# EAGLE design USB_Bit_Whacker-18F2553 (EAGLE 7.5.0)
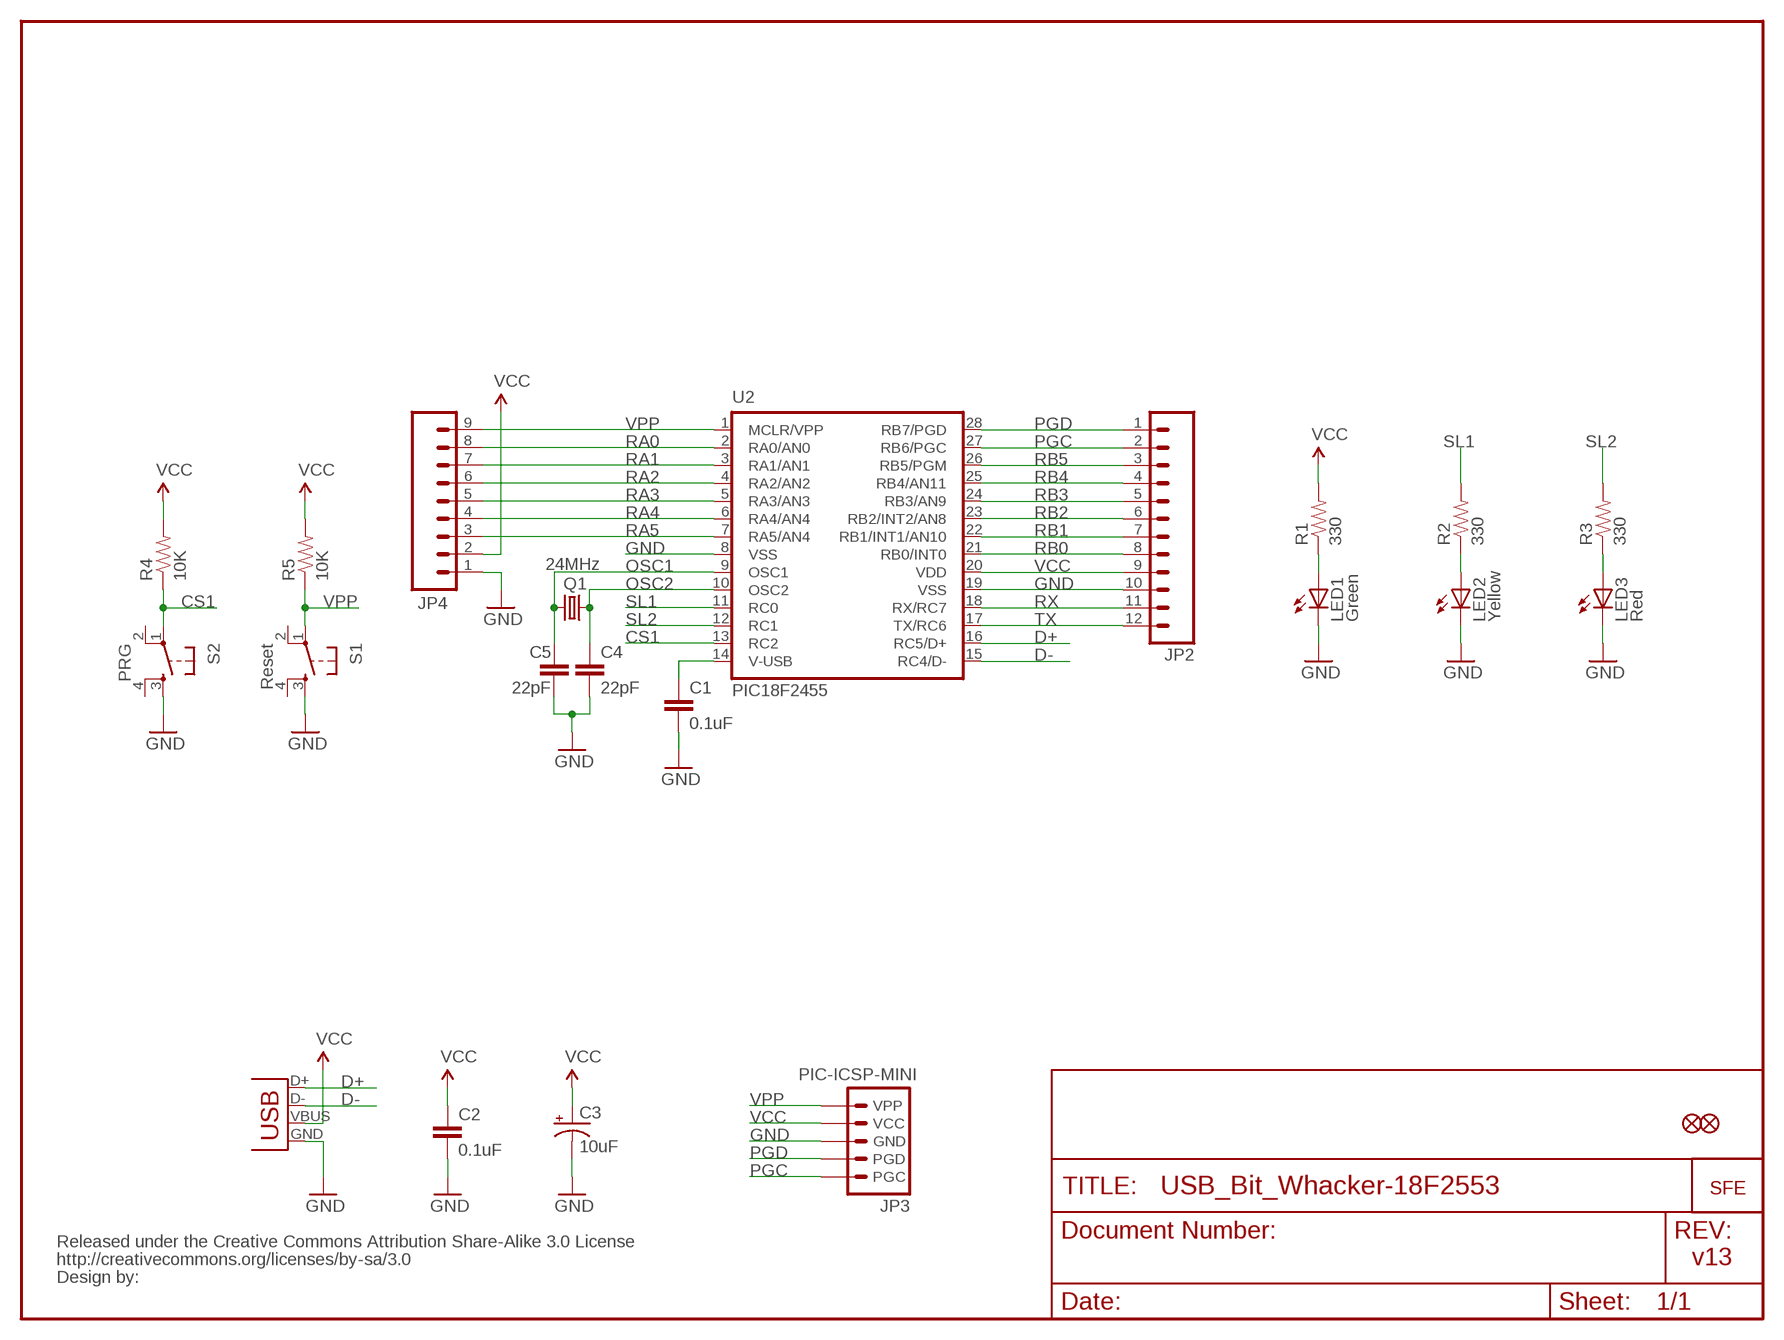
[diagram p0: schematic, sheet 1]

## Parts
C1  0.1uF  CAP0402-CAP  [0402-CAP]
C2  0.1uF  CAP0402-CAP  [0402-CAP]
C3  10uF  CAP_POL1206  [EIA3216]
C4  22pF  CAP0402-CAP  [0402-CAP]
C5  22pF  CAP0402-CAP  [0402-CAP]
FID1  FIDUCIAL1X2  [FIDUCIAL-1X2]
FID2  FIDUCIAL1X2  [FIDUCIAL-1X2]
JP2  M12PTH  [1X12]
JP3  PIC-ICSP-MINI  [PIC-ICSP-MINI]
JP4  M09  [1X09]
LED1  Green  LED1206  [LED-1206]
LED2  Yellow  LED1206  [LED-1206]
LED3  Red  LED1206  [LED-1206]
Q1  24MHz  CRYSTAL5X3  [CRYSTAL-SMD-5X3]
R1  330  RESISTOR0402-RES  [0402-RES]
R2  330  RESISTOR0402-RES  [0402-RES]
R3  330  RESISTOR0402-RES  [0402-RES]
R4  10K  RESISTOR0402-RES  [0402-RES]
R5  10K  RESISTOR0402-RES  [0402-RES]
S1  Reset  TAC_SWITCHSMD  [TACTILE_SWITCH_SMD]
S2  PRG  TAC_SWITCHSMD  [TACTILE_SWITCH_SMD]
U2  PIC18F2455  PIC18F2455SMD  [SO-28W]
U$1  LOGO-SFENEW  [SFE-NEW-WEBLOGO]
U$2  CREATIVE_COMMONS  [CREATIVE_COMMONS]
X1  USBSMD  [USB-MINIB]

## Nets
CS1: R4.1 S2.1 U2.13(RC2)
D+: U2.16(RC5/D+) X1.D+
D-: U2.15(RC4/D-) X1.D-
GND: C1.2 C2.2 C3.C(-) C4.2 C5.2 JP2.10 JP3.3(GND) JP4.1 LED1.C LED2.C LED3.C S1.3 S2.3 U2.8(VSS) U2.19(VSS) X1.GND
N$1: C1.1 U2.14(V-USB)
N$4: LED1.A R1.1
N$5: LED2.A R2.1
N$6: LED3.A R3.1
OSC1: C5.1 Q1.3 U2.9(OSC1)
OSC2: C4.1 Q1.1 U2.10(OSC2)
PGC: JP2.2 JP3.5(PGC) U2.27(RB6/PGC)
PGD: JP2.1 JP3.4(PGD) U2.28(RB7/PGD)
RA0: JP4.8 U2.2(RA0/AN0)
RA1: JP4.7 U2.3(RA1/AN1)
RA2: JP4.6 U2.4(RA2/AN2)
RA3: JP4.5 U2.5(RA3/AN3)
RA4: JP4.4 U2.6(RA4/AN4)
RA5: JP4.3 U2.7(RA5/AN4)
RB0: JP2.8 U2.21(RB0/INT0)
RB1: JP2.7 U2.22(RB1/INT1/AN10)
RB2: JP2.6 U2.23(RB2/INT2/AN8)
RB3: JP2.5 U2.24(RB3/AN9)
RB4: JP2.4 U2.25(RB4/AN11)
RB5: JP2.3 U2.26(RB5/PGM)
RX: JP2.11 U2.18(RX/RC7)
SL1: R2.2 U2.11(RC0)
SL2: R3.2 U2.12(RC1)
TX: JP2.12 U2.17(TX/RC6)
VCC: C2.1 C3.A(+) JP2.9 JP3.2(VCC) JP4.2 R1.2 R4.2 R5.2 U2.20(VDD) X1.VBUS
VPP: JP3.1(VPP) JP4.9 R5.1 S1.1 U2.1(MCLR/VPP)
Unconnected: S1.2 S1.4 S2.2 S2.4

## Notes on the sheet
- v13

## Library data of the parts
C1 C2 C4 C5 = SparkFun:CAP: Capacitor Standard 0603 ceramic capacitor, and 0.1" leaded capacitor.
C3 = SparkFun:CAP_POL: Capacitor Polarized These are standard SMD and PTH capacitors. Normally 10uF, 47uF, and 100uF in electrolytic and tantalum varieties. Always verify the external diameter of the through hole cap, it varies with capacity, voltage, and manufacturer. The EIA devices should be standard.
FID1 FID2 = SparkFun-Aesthetics:FIDUCIAL: Fiducial Alignment Points Various fiducial points for machine vision alignment.
JP2 = SparkFun:M12: Header 12 Standard 12-pin 0.1" header. Use with straight break away headers (SKU : PRT-00116), right angle break away headers (PRT-00553), swiss pins (PRT-00743), machine pins (PRT-00117), and female headers (PRT-00115).
JP3 = SparkFun:PIC-ICSP-MINI: PIC-ICSP-Mini Miniature 5-pin connection for temporary programming of PICs. Use this device in your design to save space. Program the PIC with this adapter Spark Fun Electronics SKU : BOB-00194
JP4 = SparkFun:M09: Header 9 Standard 9-pin 0.1" header. Use with straight break away headers (SKU : PRT-00116), right angle break away headers (PRT-00553), swiss pins (PRT-00743), machine pins (PRT-00117), and female headers (PRT-00115).
LED1-LED3 = SparkFun:LED: LEDs Standard schematic elements and footprints for 5mm, 3mm, 1206, and 0603 sized LEDs. 5mm - Spark Fun Electronics SKU : COM-00529 (and others)
Q1 = SparkFun:CRYSTAL: Crystals Various standard crystals. Proven footprints. Spark Fun Electronics SKU : COM-00534
R1-R5 = SparkFun:RESISTOR: Resistor Basic schematic elements and footprints for 0603, 1206, and PTH 1/10th watt (small) resistors.
S1 S2 = SparkFun:TAC_SWITCH: Momentary Switch Button commonly used for reset or general input. Spark Fun Electronics SKU : COM-00097
U2 = SparkFun:PIC18F2455
U$1 = SparkFun:LOGO-SFE: Spark Fun Electronics PCB Logo This is the standard Spark Fun Electronics PCB logo.
U$2 = SparkFun:CREATIVE_COMMONS
X1 = SparkFun:USB: USB Connectors USB-B-PTH is fully proven SKU : PRT-00139 USB-miniB is fully proven SKU : PRT-00587 USB-A-PCB is untested. USB-A-H is throughly reviewed, but untested. Spark Fun Electronics SKU : PRT-00437 USB-B-SMT is throughly reviewed, but untested. Needs silkscreen touching up. USB-A-S has not been used/tested USB-MB-H has not been used/tested

## Board
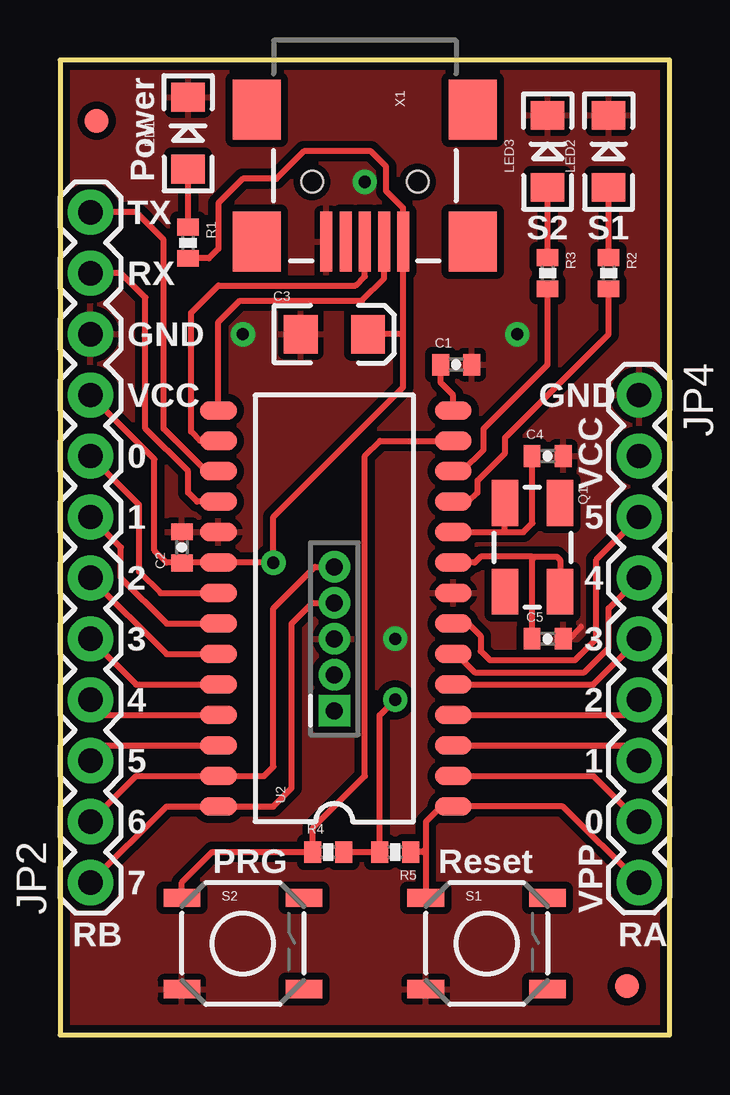
[diagram p1: board, top side]
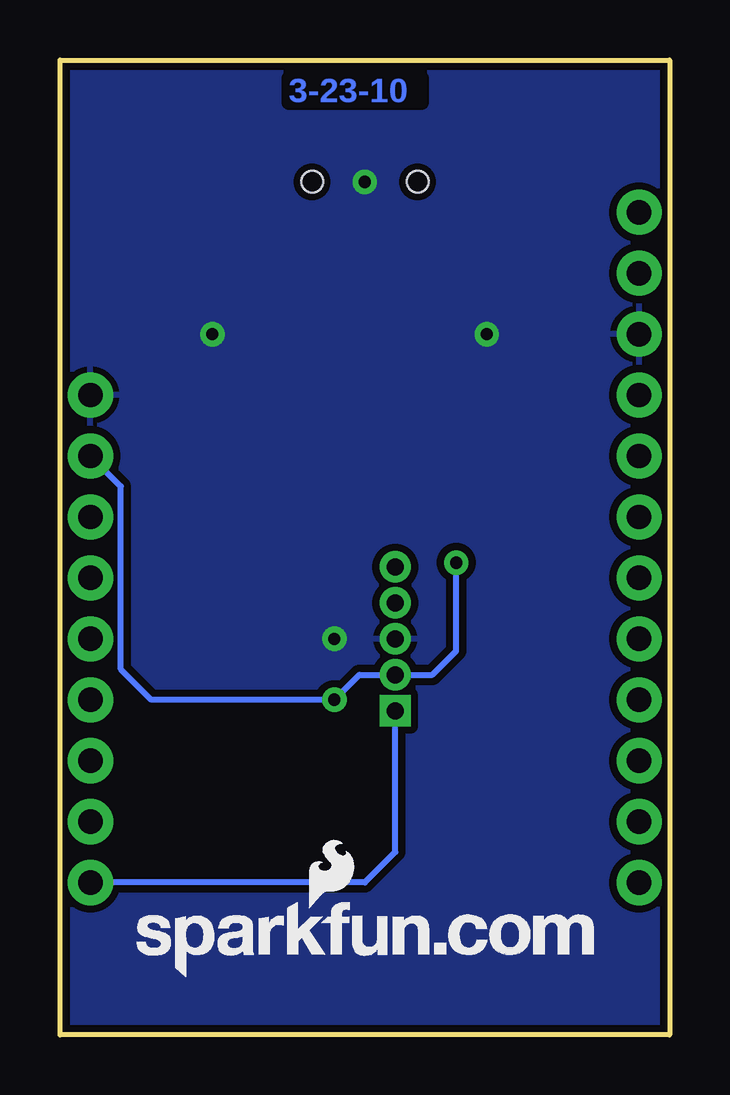
[diagram p2: board, bottom side, seen from below]

Size 25.4 x 40.64 mm. Coordinates in mm from the lower left corner, seen from the top.
Outline: 0,0 25.4,0 25.4,40.64 0,40.64 0,0
Copper layers (1*16): Top 0.035mm / dielectric 1.5mm / Bottom 0.035mm
Design rules "SparkFun": minimum track width 8mil, minimum drill 20mil, track to track 8mil, track to pad 8mil, pad to pad 8mil, via to via 8mil, smd to smd 8mil, copper to edge 10mil, drill to drill 8mil, minimum pad ring 12mil, minimum via ring 10mil, stop-mask expansion 4mil, vias tented up to drill 20mil, thermal gap 10mil

### Footprints (pad centres in the part's own frame; a part is rotated, then mirrored left to right if it is on the bottom)
0402-CAP = smd 0.7 x 0.9: 1 -0.65,0; 2 0.65,0
EIA3216 = smd 1.4 x 1.6: A 1.4,0; C -1.4,0
FIDUCIAL-1X2 = smd 1 x 1: 1 0,0
1X12 = drill 1.016 pad 1.88: 1 0,0; 2 2.54,0; 3 5.08,0; 4 7.62,0; 5 10.16,0; 6 12.7,0; 7 15.24,0; 8 17.78,0; 9 20.32,0; 10 22.86,0; 11 25.4,0; 12 27.94,0
PIC-ICSP-MINI = drill 0.7 square: 1 -3,0 | drill 0.7: 2 -1.5,0; 3 0,0; 4 1.5,0; 5 3,0
1X09 = drill 1.016 pad 1.88: 1 0,0; 2 2.54,0; 3 5.08,0; 4 7.62,0; 5 10.16,0; 6 12.7,0; 7 15.24,0; 8 17.78,0; 9 20.32,0
LED-1206 = smd 1.2 x 1.4: A -1.5,0; C 1.5,0
CRYSTAL-SMD-5X3 = smd 1.9 x 1.1: 1 -1.85,-1.15; 2 1.85,-1.15; 3 1.85,1.15; 4 -1.85,1.15
0402-RES = smd 0.7 x 0.9: 1 -0.65,0; 2 0.65,0
TACTILE_SWITCH_SMD = smd 1.524 x 0.762: 1 -2.54,1.905; 2 2.54,1.905; 3 -2.54,-1.905; 4 2.54,-1.905
SO-28W = smd 0.762 x 1.524: 1 -8.255,-4.953; 2 -6.985,-4.953; 3 -5.715,-4.953; 4 -4.445,-4.953; 5 -3.175,-4.953; 6 -1.905,-4.953; 7 -0.635,-4.953; 8 0.635,-4.953; 9 1.905,-4.953; 10 3.175,-4.953; 11 4.445,-4.953; 12 5.715,-4.953; 13 6.985,-4.953; 14 8.255,-4.953; 15 8.255,4.826; 16 6.985,4.826; 17 5.715,4.826; 18 4.445,4.826; 19 3.175,4.826; 20 1.905,4.826; 21 0.635,4.826; 22 -0.635,4.826; 23 -1.905,4.826; 24 -3.175,4.826; 25 -4.445,4.826; 26 -5.715,4.826; 27 -6.985,4.826; 28 -8.255,4.826
USB-MINIB = smd 2.5 x 0.5: D+ 2.5,0; D- 2.5,0.8; GND 2.5,-1.6; ID 2.5,-0.8; VBUS 2.5,1.6 | smd 2.5 x 2: GND@1 -3,-4.5; GND@2 -3,4.5; GND@3 2.5,4.5; GND@4 2.5,-4.5 | hole 0.9: 0,2.2; 0,-2.2

### Placement (x,y rotation side)
C1  16.51,27.94 0 top
C2  5.08,20.32 90 top
C3  11.43,29.21 0 top
C4  20.32,24.13 0 top
C5  20.32,16.51 0 top
FID1  1.52,38.1 0 top
FID2  23.62,2.03 0 top
JP2  1.27,6.35 90 top
JP3  11.43,16.51 90 top
JP4  24.13,26.67 270 top
LED1  5.33,37.59 90 top
LED2  22.86,36.83 90 top
LED3  20.32,36.83 90 top
Q1  19.68,20.32 270 top
R1  5.33,33.02 270 top
R2  22.86,31.75 270 top
R3  20.32,31.75 270 top
R4  11.18,7.62 0 top
R5  13.97,7.62 180 top
S1  17.78,3.81 0 top
S2  7.62,3.81 0 top
U2  11.43,17.78 90 top
U$1  22.23,2.41 0 bottom
U$2  19.05,-7.62 0 top  (outside the outline)
X1  12.7,35.56 270 top

### Tracks (layer width: path | path; a pad name or v marks a point on that pad's centre or on a via)
CS1
  Top 0.254: S2.1 5.08,6.35 6.35,7.62 10.54,7.62 | U2.13 13.34,24.77 12.7,24.13 12.7,10.79 10.54,8.64 10.54,7.62 | 10.54,7.62 R4.1
D+
  Top 0.254: X1.D+ 12.7,31.62 12.32,31.24 6.6,31.24 5.46,30.1 5.46,25.15 5.84,24.77 U2.16 6.73,24.77
D-
  Top 0.254: X1.D- 13.5,31.53 12.57,30.61 7.49,30.61 6.6,29.72 U2.15
GND  (via drill 0.51)
  Top 0.254: C5.2 21.21,16.51 21.72,17.02
  other vias: 13.97,16.51 12.7,35.56 7.62,29.21 19.05,29.21
  pour Top (isolate 0.305): 0,40.64 25.4,40.64 25.4,0 0,0
  pour Bottom (isolate 0.305): 0,40.64 25.4,40.64 25.4,0 0,0
N$1
  Top 0.254: C1.1 15.86,27.19 16.38,26.67 16.38,26.16 16.51,26.04 U2.14
N$4
  Top 0.254: R1.1 LED1.A
N$5
  Top 0.254: R2.1 LED2.A
N$6
  Top 0.254: 20.32,32.26 R3.1 LED3.A
OSC1
  Top 0.254: U2.9 17.27,19.68 17.53,19.94 19.68,19.94 | 19.68,19.94 20.7,19.94 20.84,19.8 Q1.3 | 19.68,19.94 19.68,19.81 19.67,19.8 C5.1
OSC2
  Top 0.254: U2.10 18.54,20.95 | 18.54,20.95 19.3,20.95 19.68,21.34 19.68,24.13 C4.1 | Q1.1 18.54,20.96 18.54,20.95
PGC
  Top 0.254: 6.73,10.79 6.99,10.79 | JP3.5 10.62,19.51 8.89,17.78 8.89,11.18 8.51,10.79 6.73,10.79 | JP2.2 3.17,10.79 U2.27 6.73,10.79
PGD
  Top 0.254: 6.73,9.53 6.99,9.53 | 4.45,9.53 U2.28 | JP2.1 4.45,9.53 | JP3.4 10.52,18.01 9.65,17.14 9.65,10.29 8.89,9.53 6.73,9.53 | U2.28 6.73,9.53 | 4.45,9.53 U2.28
RA0
  Top 0.254: U2.2 22.23,10.79 JP4.8
RA1
  Top 0.254: U2.3 23.5,12.06 JP4.7
RA2
  Top 0.254: U2.4 23.5,13.34 JP4.6
RA3
  Top 0.254: U2.5 22.23,14.61 JP4.5
RA4
  Top 0.254: U2.6 16.51,15.88 17.27,15.11 21.84,15.11 22.86,16.13 22.86,17.78 JP4.4
RA5
  Top 0.254: U2.7 17.02,17.14 17.53,16.64 17.53,16 17.91,15.62 21.46,15.62 22.35,16.51 22.35,19.81 JP4.3
RB0
  Top 0.254: U2.21 4.19,18.41 3.3,19.3 3.3,22.1 JP2.8
RB1
  Top 0.254: U2.22 4.45,17.14 2.54,19.05 2.54,20.32 JP2.7
RB2
  Top 0.254: U2.23 4.45,15.88 JP2.6
RB3
  Top 0.254: U2.24 3.17,14.61 JP2.5
RB4
  Top 0.254: U2.25 1.91,13.34 JP2.4
RB5
  Top 0.254: U2.26 1.91,12.06 JP2.3
RX
  Top 0.254: JP2.11 2.54,31.75 3.56,30.73 3.56,25.27 5.33,23.5 5.33,22.61 5.71,22.23 U2.18
SL1
  Top 0.254: U2.11 17.02,22.23 17.4,22.61 17.4,23.11 18.54,24.26 18.54,24.89 22.86,29.21 R2.2
SL2
  Top 0.254: U2.12 16.76,23.5 17.65,24.38 17.65,25.27 20.32,27.94 R3.2
TX
  Top 0.254: U2.17 6.1,23.5 4.32,25.27 4.32,33.15 3.17,34.29 JP2.12
VCC  (via drill 0.51)
  Top 0.254: 5.08,19.68 C2.1 | 5.08,19.68 U2.20 v8.89,19.68 8.89,21.59 14.3,27 14.3,29.21 | 5.08,19.68 4.45,19.68 3.94,20.19 3.94,24 JP2.9 | R1.2 6.21,32.37 6.6,32.77 6.6,34.67 7.62,35.69 9.02,35.69 10.16,36.83 12.95,36.83 13.59,36.2 13.59,35.18 14.3,34.47 X1.VBUS | 14.3,29.21 X1.VBUS | 14.3,29.21 C3.A | X1.VBUS 14.35,33.02 | R4.2 13.08,7.62 13.21,7.75 13.32,7.63 R5.2 13.32,13.32 v13.97,13.97
  Bottom 0.254: v8.89,19.68 8.89,16 9.88,15.01 JP3.2 12.93,15.01 v13.97,13.97 21.59,13.97 22.86,15.24 22.86,22.86 JP4.2
VPP
  Top 0.254: 15.24,7.75 S1.1 | 15.24,7.75 15.24,8.89 15.88,9.53 U2.1 20.95,9.53 JP4.9 | R5.1 15.11,7.62 15.24,7.75
  Bottom 0.254: JP3.1 11.43,7.62 12.7,6.35 JP4.9

### Text on the board
Bottom: 3-23-10
tPlace: Power | TX | S2 | S1 | RX | GND | VCC | GND | 0 | VCC | 1 | 5 | 2 | 4 | 3 | 3 | 4 | 2 | 5 | 1 | 6 | 0 | PRG | Reset | 7 | VPP | RB | RA